# Altium schematic sheet lra_block.SchDoc
size A; SheetNumber: 2; SheetTotal: 2
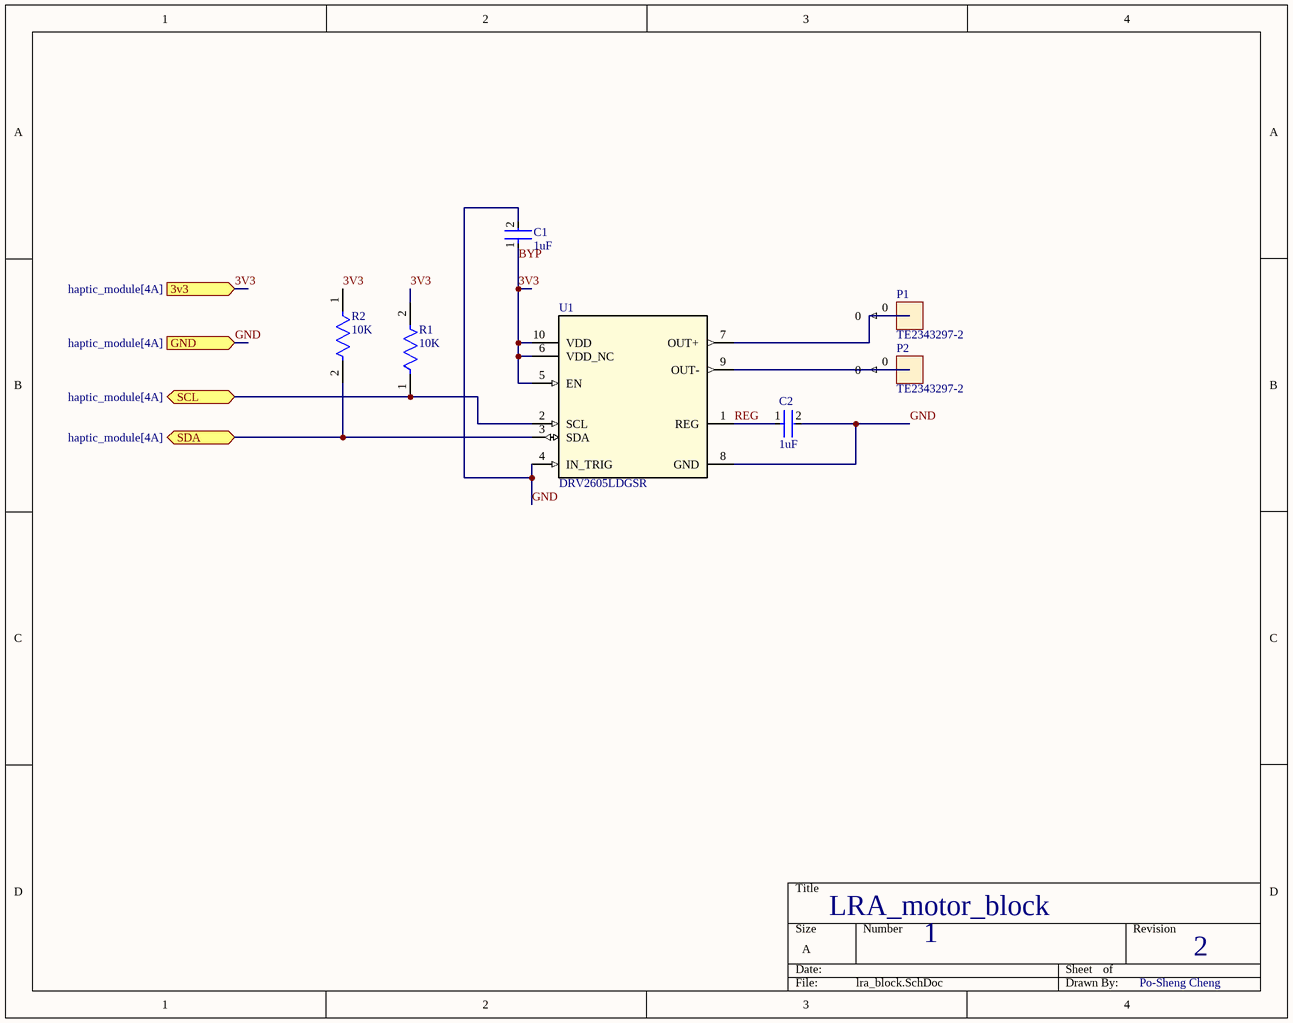
[diagram p0: lra_block.SchDoc]

## Parts
C1  1uF  [FP-CC0805-0_85-MFG]
C2  1uF  [FP-CC0805-0_85-MFG]
P1  TE2343297-2  [TE2343297-2]
P2  TE2343297-2  [TE2343297-2]
R1  10K  [FP-RT0603-MFG]
R2  10K  [FP-RT0603-MFG]
U1  DRV2605LDGSR  [DGS0010A]

## Ports
3v3 (in, see haptic_module[4A]), GND (in, see haptic_module[4A]), SCL (bidir, see haptic_module[4A]), SDA (bidir, see haptic_module[4A])

## Nets
3V3: C1.1 R1.2 R2.1 U1.5(EN) U1.6(VDD_NC) U1.10(VDD) ; port 3v3  [also labelled BYP]
GND: C1.2 C2.2 U1.4(IN_TRIG) U1.8(GND) ; port GND
REG: C2.1 U1.1(REG)
SCL: R1.1 U1.2(SCL) ; port SCL
SDA: R2.2 U1.3(SDA) ; port SDA
NetP1_0: P1.0 U1.7(OUT+)
NetP2_0: P2.0 U1.9(OUT-)

## Notes on the sheet
- LRA_motor_block
- 1
- 2
- Po-Sheng Cheng

## Library data of the parts
C1 C2 = CMP-03422-000001-1: CAP CER 1UF 16V X7R 0805; Manufacturer: Yageo; Manufacturer Part Number: CC0805KKX7R7BB105; Material: Ceramic; Tolerance: 0.1; Voltage Rating: 16 V; Category: Cap; Capacitance: 1 uF; ComponentLink2Description: Datasheet; Automotive: No; Temperature Range High: +85°C; RoHS: TRUE; Footprint Url: http://www.yageo.com/exep/pages/download/literatures/UPY-C_GEN_24.pdf; Mouser Description: Multilayer Ceramic Capacitors MLCC - SMD/SMT 1.0uF 16V X7R 10%; Height: 0.95mm; Ipc Land Pattern Name: CAPC200125X85; Temperature: -30°C to +85°C; Lead Free: Yes; Value: 1 uF; Temperature Characteristic: X7R; Package: CC0805-0.85; Temperature Range Low: -30°C; Device Class L1: Passive Components; Device Class L3: Ceramic Capacitors; Octopart: https://octopart.com/cc0805kkx7r7bb105-yageo-8376555; ComponentLink2URL: http://www.yageo.com/documents/recent/UPY-GPHC_Y5V_6.3V-to-50V_8.pdf; Device Class L2: Capacitors; Digikey Description: CAP CER 1UF 16V X7R 0805
R1 R2 = CMP-2000-04517-2: RES SMD 10K OHM 0.1% 1/10W 0603; Manufacturer Part Number: RT0603BRE0710KL; Manufacturer: Yageo; Tolerance: 0.001; Temperature Coefficient: 50 ppm/°C; Power Rating: 0.1W; Resistance: 10KΩ; Value: 10KΩ; Voltage Rating: 75V; Temperature Range High: +155°C; Device Class L2: Resistors; Temperature: -55°C to +155°C; Series: RT; Device Class L1: Passive Components; Temperature Range Low: -55°C; Automotive: No; Mouser Description: Res Thin Film 0603 10K Ohm 0.1% 1/10W ±50ppm/°C Molded SMD SMD Paper T/R; Device Class L3: Chip SMD Resistors; RoHS: TRUE; Package: RT0603; Footprint Url: http://www.yageo.com/exep/pages/download/literatures/PYu-R_Mount_10.pdf; Octopart: https://octopart.com/rt0603bre0710kl-yageo-1273959; ComponentLink2URL: http://www.yageo.com/documents/recent/PYu-RT_1-to-0.01_RoHS_L_9.pdf; Composition: Thin Film; Category: Res; Lead Free: Yes; Height: 0.55mm; Digikey Description: RES SMD 10K OHM 0.1% 1/10W 0603; Ipc Land Pattern Name: RESC16080X45; ComponentLink2Description: Datasheet
U1 = DRV2605LDGSR: No Description Available; Mfr_Name: Texas Instruments; CompType: IC; TYPE: TYPE; RefDes: RefDes; PartNumber: DRV2605LDGS; PackageReference: DGS0010A; MountType: SMT; RoHS: Y; Manufacturer: Texas Instruments